# Altium schematic sheet Slave_Sensor.SchDoc
size A3
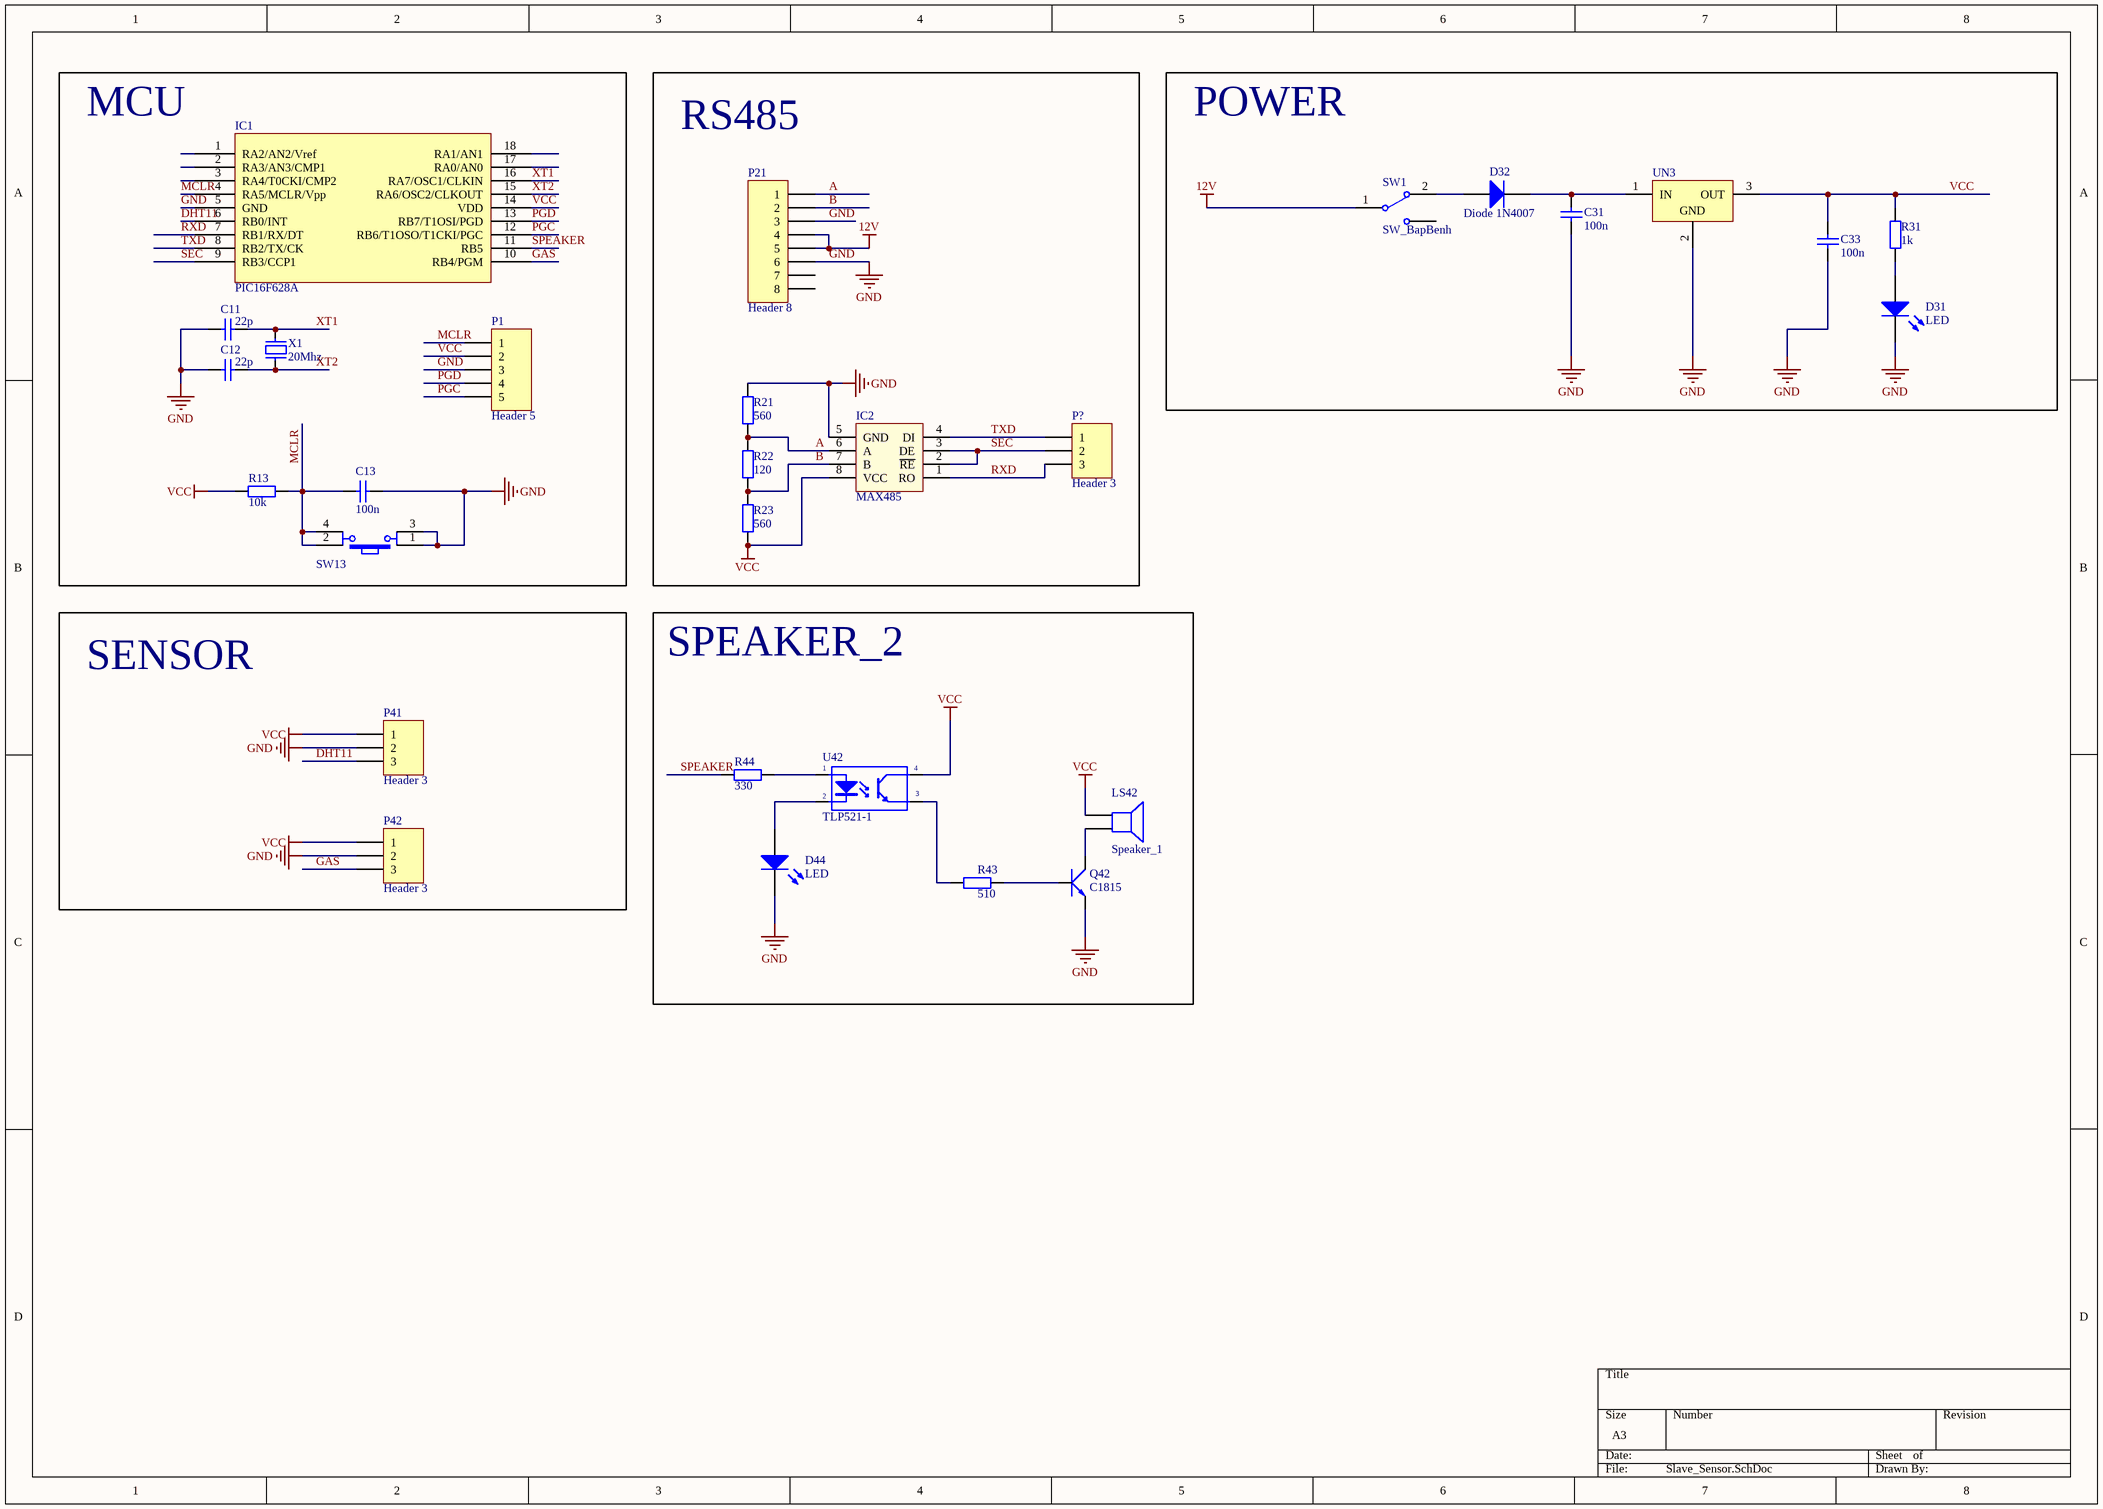
[diagram p0: Slave_Sensor.SchDoc]

## Parts
C11  value 22p  [C-NP-0805]  (hidden comment: Cap Non-pol)
C12  value 22p  [C-NP-0805]  (hidden comment: Cap Non-pol)
C13  value 100n  [CAP_SMD_0805]  (hidden comment: Capacitor Ceramic)
C31  value 100n  [C-NP-0805]  (hidden comment: Cap Non-pol)
C33  value 100n  [C-NP-0805]  (hidden comment: Cap Non-pol)
D31  LED  [LED-0 3mm RED]
D32  Diode 1N4007  [DO-41]
D44  LED  [LED-0 3mm YELLOW]
IC1  PIC16F628A  [DIP18/W0.3]
IC2  MAX485  [DIP8/W0.3]
LS42  Speaker_1  [SPEAKER]
P1  Header 5  [Header 5]
P21  Header 8  [RJ11]
P41  Header 3  [Header 3]
P42  Header 3  [Header 3]
P?  Header 3  [Header 3]
Q42  C1815  [QTO-92]
R13  value 10k  [DIEN TRO 0805]  (hidden comment: RES_SMD_0805)
R21  value 560  [DIEN TRO 0805]  (hidden comment: RES_SMD_0805)
R22  value 120  [DIEN TRO 0805]  (hidden comment: RES_SMD_0805)
R23  value 560  [DIEN TRO 0805]  (hidden comment: RES_SMD_0805)
R31  value 1k  [DIEN TRO 0805]  (hidden comment: RES_SMD_0805)
R43  value 510  [DIEN TRO 0805]  (hidden comment: RES_SMD_0805)
R44  value 330  [DIEN TRO 0805]  (hidden comment: RES_SMD_0805)
SW1  SW_BapBenh  [SW_Bapbenh]
SW13  SW7  [SW4]  (value not drawn)
U42  TLP521-1  [DIP4/W0.3]
UN3  L78M05CP  [QTO-220]  (value not drawn)
X1  20Mhz  [XT2]

## Blocks framed on the sheet
MCU: C11-C13 IC1 P1 R13 SW13 X1
RS485: IC2 P21 P? R21-R23
POWER: C31 C33 D31 D32 R31 SW1 UN3
SENSOR: P41 P42
SPEAKER_2: D44 LS42 Q42 R43 R44 U42

## Nets
12V: P21.4 P21.5 SW1.1
GND: C11.2 C12.2 C13.1 C31.1 C33.1 D31.2(K) D44.2(K) IC1.5(GND) IC2.5(GND) P1.3 P21.3 P21.6 P41.2 P42.2 Q42.1(E) R21.2 SW13.1 SW13.3 UN3.2(GND)
VCC: C33.2 IC1.14(VDD) IC2.8(VCC) LS42.1 P1.2 P41.1 P42.1 R13.2 R23.1 R31.2 U42.4(C) UN3.3(OUT)
A: IC2.6(A) P21.1 R21.1 R22.2
B: IC2.7(B) P21.2 R22.1 R23.2
DHT11: IC1.6(RB0/INT) P41.3
GAS: IC1.10(RB4/PGM) P42.3
MCLR: C13.2 IC1.4(RA5/MCLR/Vpp) P1.1 R13.1 SW13.2 SW13.4
PGC: IC1.12(RB6/T1OSO/T1CKI/PGC) P1.5
PGD: IC1.13(RB7/T1OSI/PGD) P1.4
RXD: IC1.7(RB1/RX/DT) IC2.1(RO) P?.3
SEC: IC1.9(RB3/CCP1) IC2.2(~{RE}) IC2.3(DE) P?.2
SPEAKER: IC1.11(RB5) R44.2
TXD: IC1.8(RB2/TX/CK) IC2.4(DI) P?.1
XT1: C11.1 IC1.16(RA7/OSC1/CLKIN) X1.2
XT2: C12.1 IC1.15(RA6/OSC2/CLKOUT) X1.1
NetC31_2: C31.2 D32.2(K) UN3.1(IN)
NetD31_1: D31.1(A) R31.1
NetD32_1: D32.1(A) SW1.2
NetD44_1: D44.1(A) U42.2(K)
NetLS42_2: LS42.2 Q42.2(C)
NetQ42_3: Q42.3(B) R43.2
NetR43_1: R43.1 U42.3(E)
NetR44_1: R44.1 U42.1(A)

Not connected (* = marked no-connect by the designer): IC1 1(RA2/AN2/Vref) 2(RA3/AN3/CMP1) 3(RA4/T0CKI/CMP2) 17(RA0/AN0) 18(RA1/AN1); P21 7 8

## Library data of the parts
C11 C12 C31 C33 = Cap Non-pol: Non-polarized Capacitor; Published: 8-Jun-2000; LatestRevisionDate: 17-Jul-2002; LatestRevisionNote: Re-released for DXP Platform.; PackageReference: RAD-0.3; Publisher: Altium Limited
C13 = CapSMD: Capacitor; Published: 8-Jun-2000; LatestRevisionDate: 17-Jul-2002; LatestRevisionNote: Re-released for DXP Platform.; PackageReference: RAD-0.3; Publisher: Altium Limited
D31 D44 = LED: Typical LED; Published: 8-Jun-2000; LatestRevisionDate: 08-Jul-2005; LatestRevisionNote: Mech Layer 1 removed.; PackageReference: LED-1; Publisher: Altium Limited
D32 = Diode 1N4007: 1 Amp General Purpose Rectifier; Published: 8-Jun-2000; LatestRevisionDate: 17-Jul-2002; LatestRevisionNote: Re-released for DXP Platform.; DatasheetVersion: 1998; PackageVersion: Aug-1999; PackageReference: DO-41; Publisher: Altium Limited; PackageDescription: Diode, Axial; Body 5.2 x 2.7 mm (LxDia. max), Lead Dia. 0.86 mm (max); Code_JEDEC: DO-204-AL; ComponentLink1Description: Manufacturer Link; ComponentLink1URL: http://www.fairchildsemi.com/; ComponentLink2Description: Datasheet; ComponentLink2URL: http://www.fairchildsemi.com/ds/1N%2F1N4001.pdf
IC2 = MAX485: RS232 - RS485 (Same sn75176)
LS42 = Speaker_1: Loudspeaker; Published: 24-Mar-1999; LatestRevisionDate: 17-Jul-2002; LatestRevisionNote: Re-released for DXP Platform.; PackageReference: PIN2; Publisher: Altium Limited
P1 = Header 5: Header, 5-Pin; LatestRevisionDate: 17-Jul-2002; LatestRevisionNote: Re-released for DXP Platform.; Publisher: Altium Limited
P21 = Header 8: Header, 8-Pin; LatestRevisionDate: 17-Jul-2002; LatestRevisionNote: Re-released for DXP Platform.; Publisher: Altium Limited
P41 P42 P? = Header 3: Header, 3-Pin; LatestRevisionDate: 17-Jul-2002; LatestRevisionNote: Re-released for DXP Platform.; Publisher: Altium Limited
Q42 = C1815: NPN 600mW, ECB; Value: C1815
R13 R21-R23 R31 R43 R44 = RES_SMD_0805: RES_0805; Published: 8-Jun-2000; LatestRevisionDate: 17-Jul-2002; LatestRevisionNote: Re-released for DXP Platform.; PackageReference: AXIAL-0.4; Publisher: Altium Limited
SW13 = SW4: Switch button 4 pin; Value: Button chip 4 pin
U42 = TLP521-1: Single Opto; Value: TLP5211
UN3 = L78M05CP: Positive Voltage Regulator; Note: Tab is connected to pin 3 (GND).; Published: 24-Aug-2001; LatestRevisionDate: 17-Jul-2002; LatestRevisionNote: Re-released for DXP Platform.; DatasheetVersion: Apr-1994; PackageVersion: Jul-1998; PackageReference: ISOWATT220AB; Publisher: Altium Limited; PackageDescription: TO, Thru-Hole, Vertical, Heatsink Mounted; 3 In-Line Leads; Pitch 2.54 mm; Pin sequence 1, 3, 2; ComponentLink1Description: Manufacturer Link; ComponentLink1URL: http://www.st.com/; ComponentLink2Description: Datasheet; ComponentLink2URL: http://www.st.com/stonline/products/literature/ds/2146/l78m05c.pdf
X1 = XT2: Crystal For all Crystal 2pin.; Value: 4Mhz